# EAGLE design DMXTX (EAGLE 7.7.0)
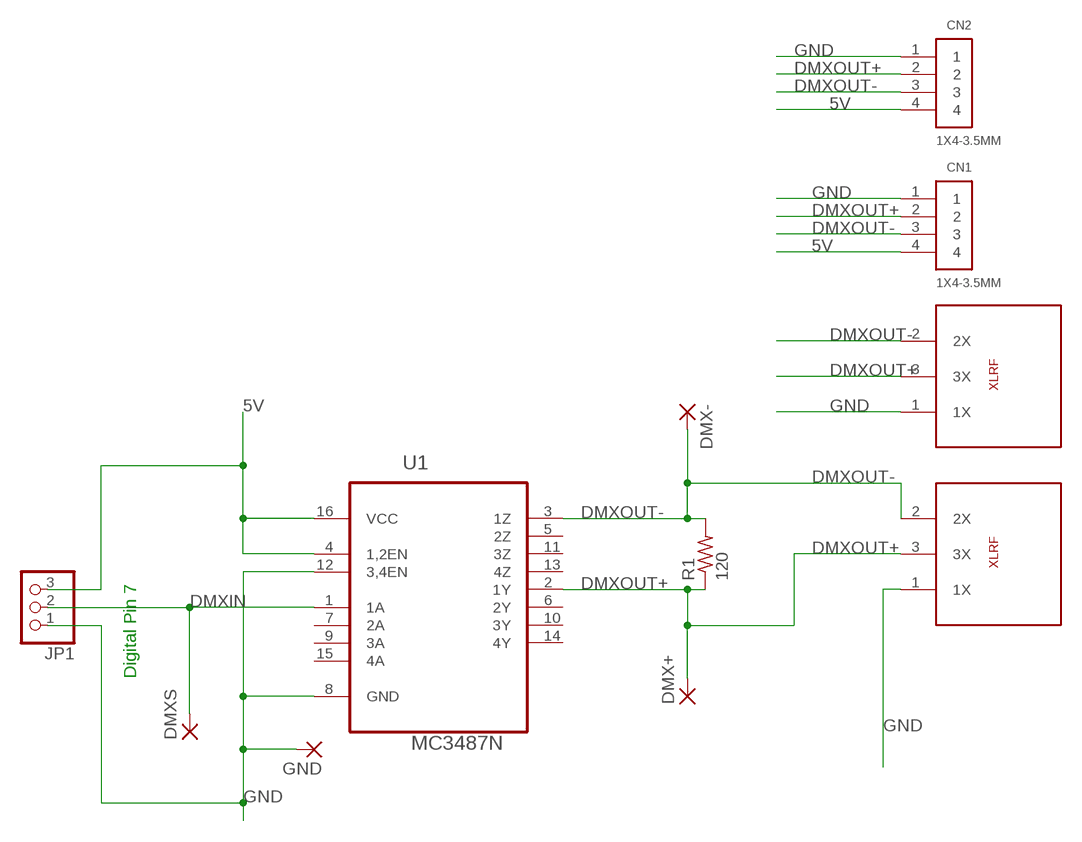
[diagram p0: schematic, sheet 1]

## Parts
CN1  1X4-3.5MM  [1X04-3.5MM]
CN2  1X4-3.5MM  [1X04-3.5MM]
DMX+  3,81/1,4  [3,81/1,4]
DMX-  3,81/1,4  [3,81/1,4]
DMXS  3,81/1,4  [3,81/1,4]
GND  3,81/1,4  [3,81/1,4]
JP1  PINHD-1X3  [1X03]
R1  120  R-US_0414/15  [0414/15]
U1  MC3487N  [DIP254P762X508-16]
U$1  XLRCONNECTOR  [DMXF3PIN]
U$2  XLRCONNECTOR  [DMXF3PIN]

## Nets
5V: CN1.4 CN2.4 JP1.3 U1.4(1,2EN) U1.16(VCC)
DMXIN: DMXS.1(P) JP1.2 U1.1(1A)
DMXOUT+: CN1.2 CN2.2 DMX+.1(P) R1.1 U1.2(1Y) U$1.3(3X) U$2.3(3X)
DMXOUT-: CN1.3 CN2.3 DMX-.1(P) R1.2 U1.3(1Z) U$1.2(2X) U$2.2(2X)
GND: CN1.1 CN2.1 GND.1(P) JP1.1 U1.8(GND) U1.12(3,4EN) U$1.1(1X) U$2.1(1X)
Unconnected: U1.5(2Z) U1.6(2Y) U1.7(2A) U1.9(3A) U1.10(3Y) U1.11(3Z) U1.13(4Z) U1.14(4Y) U1.15(4A)

## Notes on the sheet
- Digital Pin 7

## Library data of the parts
CN1 CN2 = adafruit:1X4: 4-pin connector
DMX+ DMX- DMXS GND = wirepad:3,81/1,4: THROUGH-HOLE PAD
JP1 = adafruit:PINHD-1X3: PIN HEADER
R1 = rcl:R-US_: RESISTOR, American symbol
U1 = Texas Instruments_By_element14_Batch_1:MC3487N: QUADRUPLE DIFFERENTIAL LINE DRIVER; MPN: MC3487N; OC_FARNELL: -; OC_NEWARK: 07F5179; PACKAGE: PDIP-16; SUPPLIER: Texas Instruments
U$1 U$2 = DMX:XLRCONNECTOR: SC1906-ND

## Board
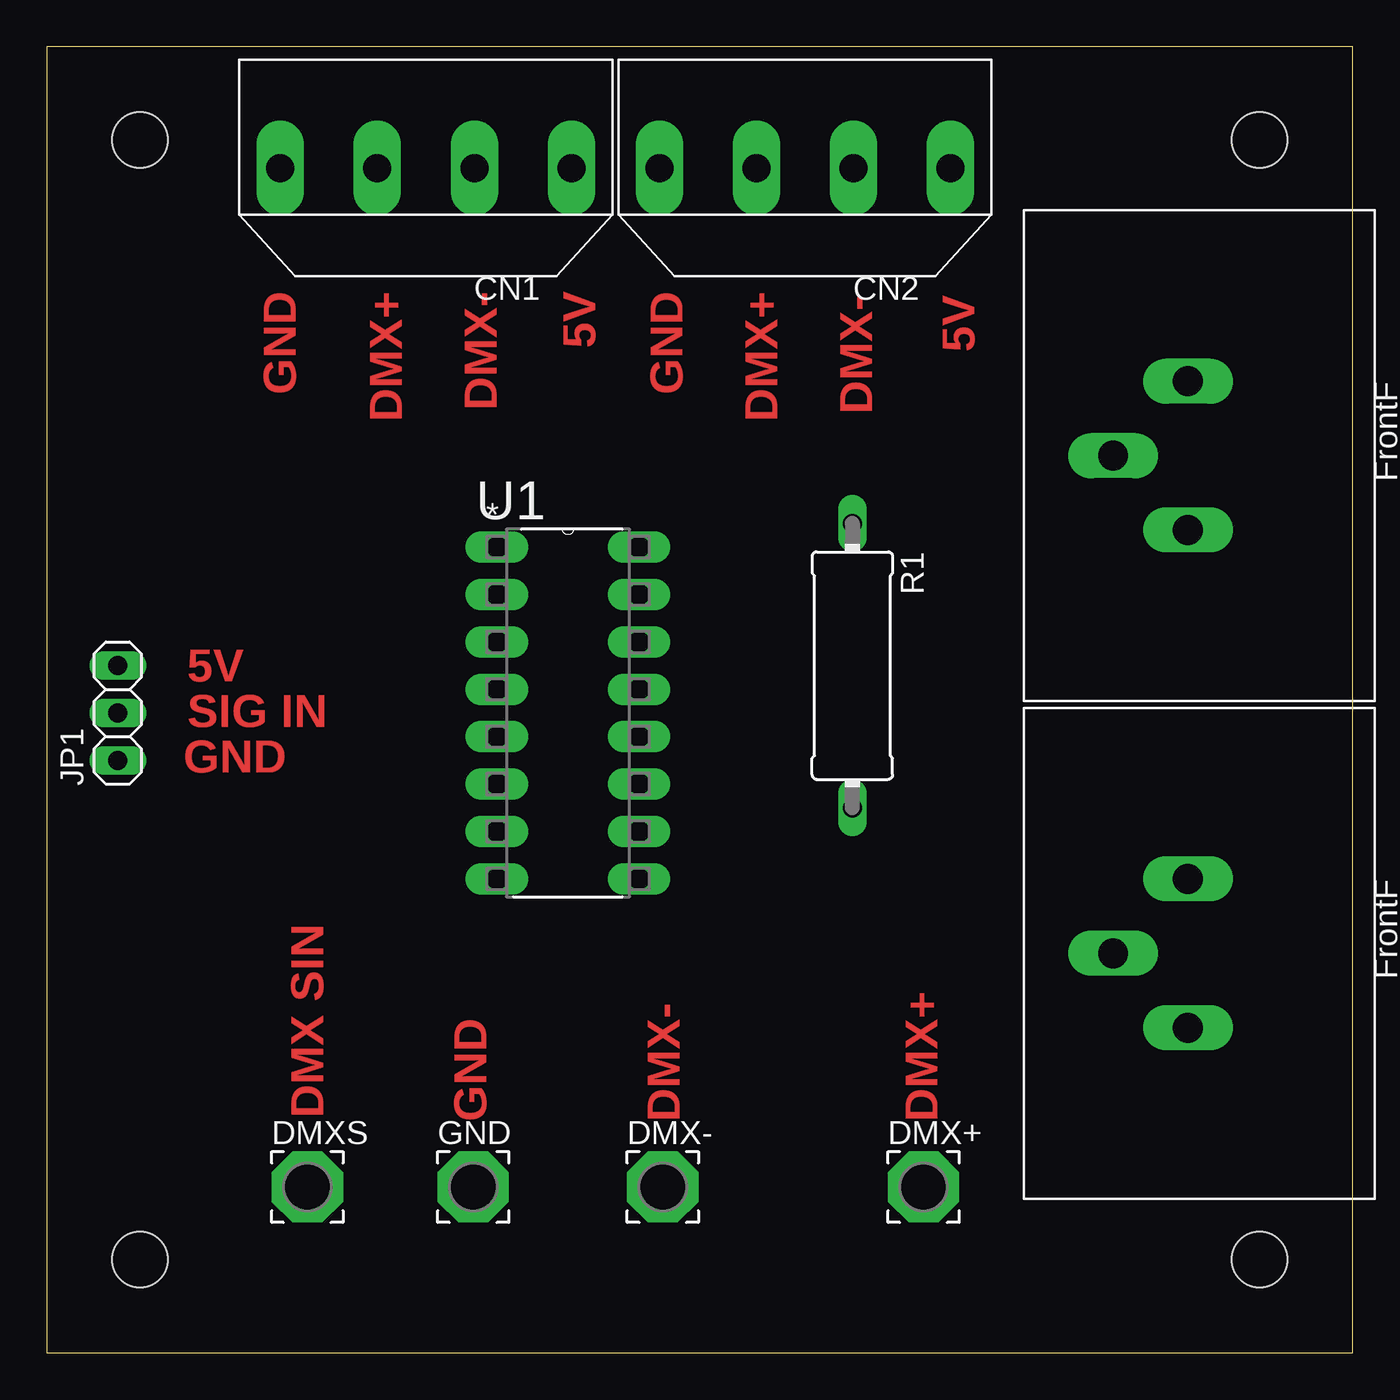
[diagram p1: board, top side]
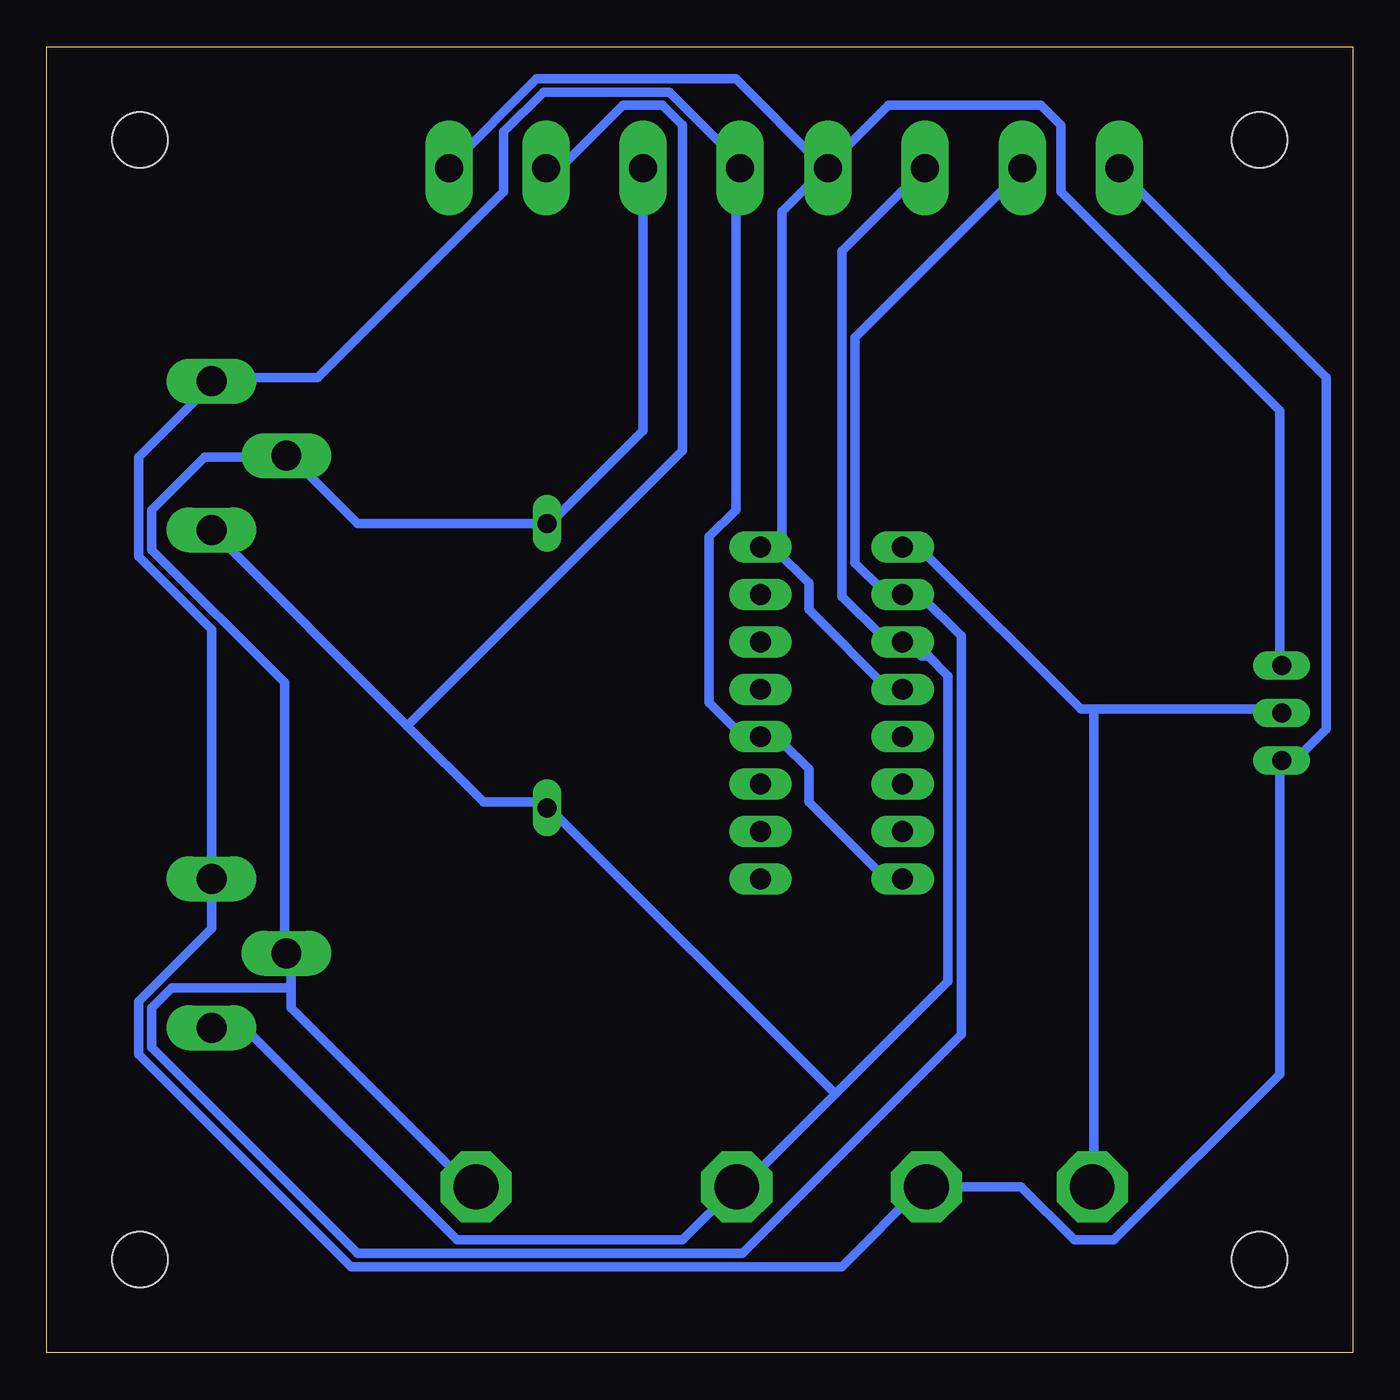
[diagram p2: board, bottom side, seen from below]

Size 70 x 70 mm. Coordinates in mm from the lower left corner, seen from the top.
Outline: 0,0 70,0 70,70 0,70 0,0
Copper layers (1*16): Top 0.035mm / dielectric 1.5mm / Bottom 0.035mm
Design rules "default *": minimum track width 20mil, minimum drill 0.8mm, track to track 8mil, track to pad 20mil, pad to pad 8mil, via to via 8mil, smd to smd 8mil, copper to edge 40mil, drill to drill 8mil, minimum pad ring 10mil, minimum via ring 8mil, stop-mask expansion 4mil, vias tented up to drill 0mil, thermal gap 10mil
Holes 3 mm at 5,5 65,5 65,65 5,65

### Footprints (pad centres in the part's own frame; a part is rotated, then mirrored left to right if it is on the bottom)
1X04-3.5MM = drill 1.5 pad 2.54 long: 1 -7.8,0; 2 -2.6,0; 3 2.6,0; 4 7.8,0
3,81/1,4 = drill 2.4 pad 3.81 octagon: 1 0,0
1X03 = drill 1.016 long: 1 -2.54,0; 2 0,0; 3 2.54,0
0414/15 = drill 1.016 long: 1 -7.62,0; 2 7.62,0
DIP254P762X508-16 = drill 1.118 long: 1 -7.62,17.78; 2 -7.62,15.24; 3 -7.62,12.7; 4 -7.62,10.16; 5 -7.62,7.62; 6 -7.62,5.08; 7 -7.62,2.54; 8 -7.62,0; 9 0,0; 10 0,2.54; 11 0,5.08; 12 0,7.62; 13 0,10.16; 14 0,12.7; 15 0,15.24; 16 0,17.78
DMXF3PIN = drill 1.6 long: 1 12.497,0; 2 12.497,7.976; 3 16.51,3.988

### Placement (x,y rotation side)
CN1  20.32,63.5 0 top
CN2  40.64,63.5 0 top
DMX+  46.99,8.89 0 top
DMX-  33.02,8.89 0 top
DMXS  13.97,8.89 0 top
GND  22.86,8.89 0 top
JP1  3.81,34.29 90 top
R1  43.18,36.83 270 top
U1  31.75,25.4 0 top
U$1  73.66,25.4 180 top
U$2  73.66,52.07 180 top

### Tracks (layer width: path | path; a pad name or v marks a point on that pad's centre or on a via)
5V
  Bottom 0.508: U1.4 24.89,35.56 29.16,39.83 29.16,41.25 30.94,43.03 31.65,43.03 U1.16 30.58,43.03 30.58,61.16 28.45,63.3 CN1.4 | JP1.3 3.91,36.98 3.91,50.49 15.65,62.23 15.65,65.79 16.71,66.85 24.89,66.85 28.09,63.65 CN1.4 | CN2.4 48.36,63.65 43.74,68.28 33.07,68.28 28.45,63.65 CN1.4
DMXIN
  Bottom 0.508: 13.87,34.49 14.58,34.49 23.11,43.03 23.82,43.03 U1.1 | 13.87,34.49 3.91,34.49 JP1.2 | 13.87,34.49 13.87,8.89 DMXS.1
DMXOUT+
  Bottom 0.508: CN1.2 17.78,63.3 26.67,54.41 26.67,42.32 25.25,40.89 24.18,40.89 U1.2 23.82,40.54 23.11,40.54 20.98,38.41 20.98,17.07 32.72,5.33 53.34,5.33 64.36,16.36 64.36,18.49 63.3,19.56 56.9,19.56 | 56.9,19.56 56.9,18.49 47.3,8.89 DMX+.1 | 56.9,19.56 56.9,21.34 U$1.3 57.25,21.69 57.25,35.92 64.36,43.03 64.36,45.16 61.52,48.01 57.25,48.01 U$2.3 56.9,48.01 53.34,44.45 R1.1 43.03,44.45 38.05,49.43 38.05,63.3 CN2.2
DMXOUT-
  Bottom 0.508: U$2.2 50.67,33.6 | 50.67,33.6 46.58,29.52 43.38,29.52 R1.2 43.03,29.16 27.74,13.87 | 50.67,33.6 35.92,48.36 35.92,65.79 36.98,66.85 39.12,66.85 42.32,63.65 43.03,63.65 CN2.3 | CN1.3 23.11,63.3 27.38,59.03 27.38,40.54 25.25,38.41 24.18,38.41 U1.3 23.82,38.05 23.11,37.34 22.76,37.34 21.69,36.27 21.69,19.91 27.74,13.87 | U$1.2 59.38,17.42 48.01,6.04 35.92,6.04 33.07,8.89 DMX-.1 32.72,8.89 27.74,13.87
GND
  Bottom 0.508: U1.8 24.18,25.6 25.25,25.6 29.16,29.52 29.16,31.29 30.58,32.72 31.65,32.72 U1.12 32,33.07 32.72,33.07 34.49,34.85 34.49,43.74 33.07,45.16 33.07,63.3 CN2.1 32.72,63.65 36.63,67.56 43.38,67.56 45.52,65.43 45.52,62.23 55.47,52.27 61.16,52.27 U$2.1 61.16,51.92 65.08,48.01 65.08,42.67 61.16,38.76 U$1.1 61.16,22.76 65.08,18.85 65.08,16 53.7,4.62 27.38,4.62 23.11,8.89 GND.1 17.78,8.89 14.94,6.04 12.8,6.04 3.91,14.94 3.91,31.65 JP1.1 3.56,32 2.85,32 1.42,33.43 1.42,52.27 12.45,63.3 CN1.1

### Text on the board
Top: GND | DMX+ | DMX- | 5V | GND | DMX+ | DMX- | 5V | 5V | SIG IN | GND | DMX SIN | GND | DMX- | DMX+